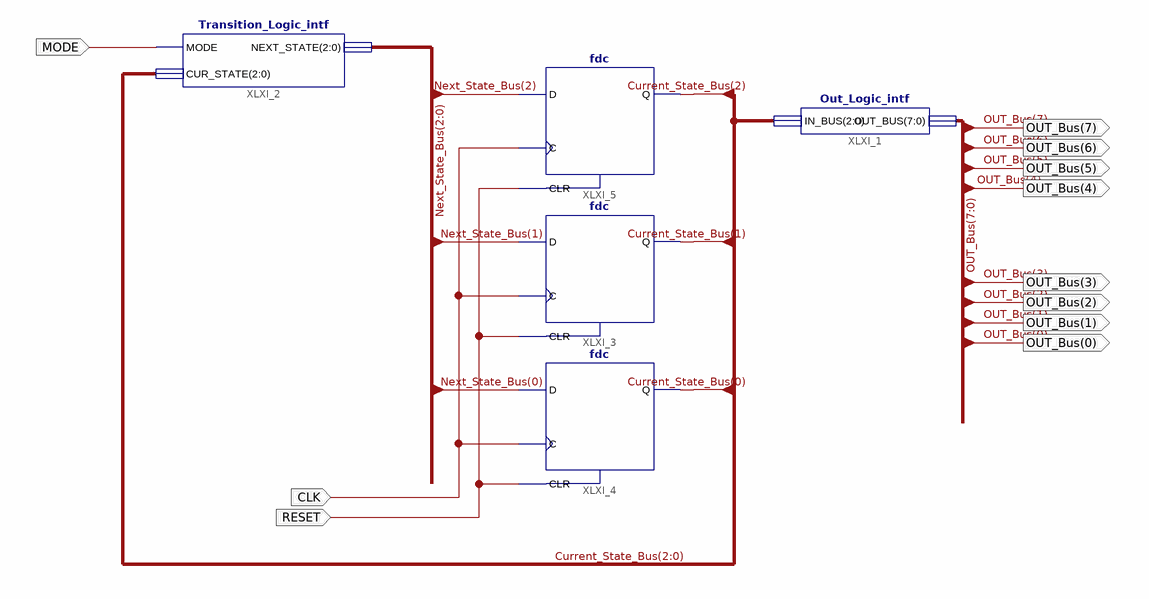
[diagram p0: schematic sheet 1]
// Xilinx ISE schematic Light_Controller.sch (spartan3a) as structural Verilog: 5 symbols, 11 ports
module Light_Controller (
  input  MODE,
  input  RESET,
  input  CLK,
  output [7:0] OUT_Bus
);

  wire [2:0] Current_State_Bus, Next_State_Bus;

  Out_Logic_intf XLXI_1 (.IN_BUS(Current_State_Bus), .OUT_BUS(OUT_Bus));
  fdc XLXI_3 (.C(CLK), .CLR(RESET), .D(Next_State_Bus[1]), .Q(Current_State_Bus[1]));
  fdc XLXI_5 (.C(CLK), .CLR(RESET), .D(Next_State_Bus[2]), .Q(Current_State_Bus[2]));
  Transition_Logic_intf XLXI_2 (.MODE(MODE), .CUR_STATE(Current_State_Bus), .NEXT_STATE(Next_State_Bus));
  fdc XLXI_4 (.C(CLK), .CLR(RESET), .D(Next_State_Bus[0]), .Q(Current_State_Bus[0]));
endmodule
